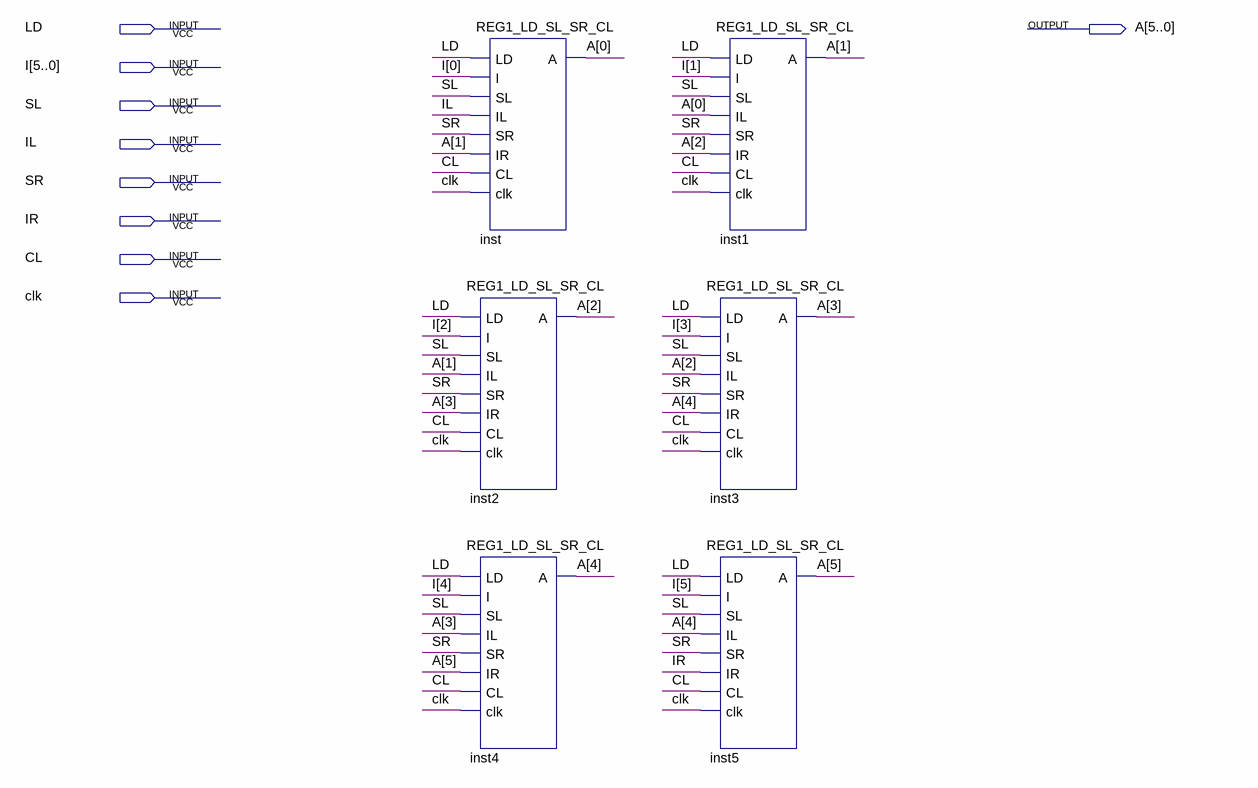
[diagram p0: schematic sheet]
// Quartus schematic REG6_LD_SL_SR_CL.bdf as structural Verilog: 6 symbols, 9 pins
module REG6_LD_SL_SR_CL (
  input  LD,
  input  [5:0] I,
  input  SL,
  input  IL,
  input  SR,
  input  IR,
  input  CL,
  input  clk,
  output [5:0] A
);

  REG1_LD_SL_SR_CL inst (.LD(LD), .I(I[0]), .SL(SL), .IL(IL), .SR(SR), .IR(A[1]), .CL(CL), .clk(clk), .A(A[0]));
  REG1_LD_SL_SR_CL inst2 (.LD(LD), .I(I[2]), .SL(SL), .IL(A[1]), .SR(SR), .IR(A[3]), .CL(CL), .clk(clk), .A(A[2]));
  REG1_LD_SL_SR_CL inst4 (.LD(LD), .I(I[4]), .SL(SL), .IL(A[3]), .SR(SR), .IR(A[5]), .CL(CL), .clk(clk), .A(A[4]));
  REG1_LD_SL_SR_CL inst1 (.LD(LD), .I(I[1]), .SL(SL), .IL(A[0]), .SR(SR), .IR(A[2]), .CL(CL), .clk(clk), .A(A[1]));
  REG1_LD_SL_SR_CL inst3 (.LD(LD), .I(I[3]), .SL(SL), .IL(A[2]), .SR(SR), .IR(A[4]), .CL(CL), .clk(clk), .A(A[3]));
  REG1_LD_SL_SR_CL inst5 (.LD(LD), .I(I[5]), .SL(SL), .IL(A[4]), .SR(SR), .IR(IR), .CL(CL), .clk(clk), .A(A[5]));
endmodule
